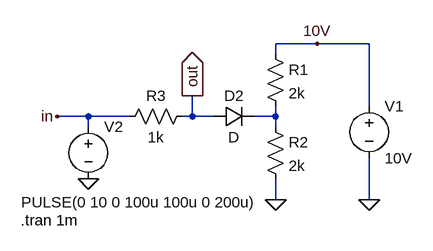
[diagram p0: schematic diode_exo1.asc]
diode_exo1.asc, the LTspice schematic file:
Version 4
SHEET 1 880 680
WIRE 64 48 0 48
WIRE 144 48 64 48
WIRE 0 64 0 48
WIRE 144 144 144 48
WIRE -288 160 -336 160
WIRE -224 160 -288 160
WIRE -128 160 -128 128
WIRE -128 160 -144 160
WIRE -96 160 -128 160
WIRE 0 160 0 144
WIRE 0 160 -32 160
WIRE -288 176 -288 160
WIRE 0 176 0 160
WIRE 0 288 0 256
WIRE 144 288 144 224
FLAG 144 288 0
FLAG -288 256 0
FLAG -128 128 out
IOPIN -128 128 Out
FLAG -336 160 in
FLAG 0 288 0
FLAG 64 48 10V
SYMBOL voltage 144 128 R0
WINDOW 123 0 0 Left 0
WINDOW 39 0 0 Left 0
SYMATTR InstName V1
SYMATTR Value 10V
SYMBOL res -128 144 R90
WINDOW 0 0 56 VBottom 0
WINDOW 3 32 56 VTop 0
SYMATTR InstName R3
SYMATTR Value 1k
SYMBOL voltage -288 160 R0
WINDOW 123 0 0 Left 0
WINDOW 39 0 0 Left 0
WINDOW 3 -103 132 Left 0
SYMATTR InstName V2
SYMATTR Value PULSE(0 10 0 100u 100u 0 200u)
SYMBOL diode -96 176 R270
WINDOW 0 32 32 VTop 0
WINDOW 3 0 32 VBottom 0
SYMATTR InstName D2
SYMBOL res -16 48 R0
SYMATTR InstName R1
SYMATTR Value 2k
SYMBOL res -16 160 R0
SYMATTR InstName R2
SYMATTR Value 2k
TEXT -392 320 Left 0 !.tran 1m

The netlist it stands for:
* diode_exo1.asc
V1 10V 0 10V
R3 out in 1k
V2 in 0 PULSE(0 10 0 100u 100u 0 200u)
D2 out N001 D
R1 10V N001 2k
R2 N001 0 2k
.model D D
.lib standard.dio
.tran 1m
.backanno
.end